# Altium schematic sheet Batmngt.SchDoc
size A4
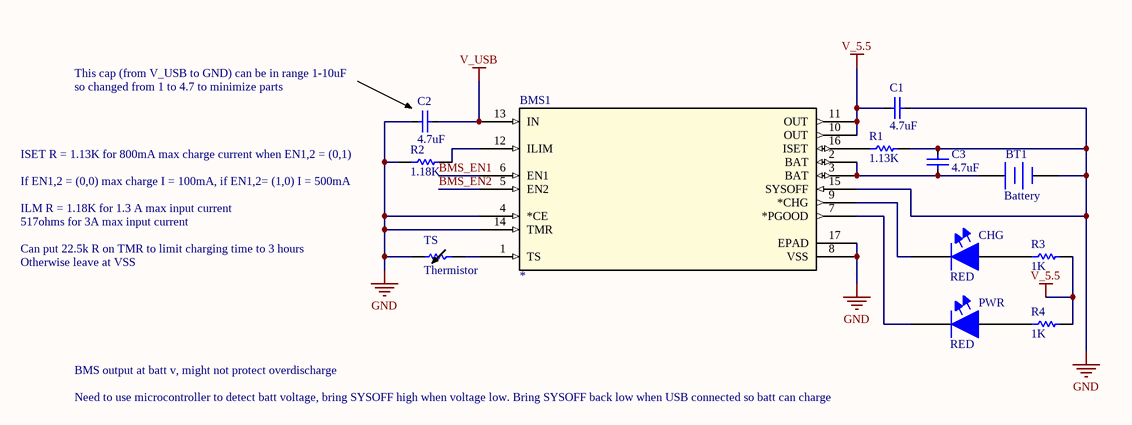
[diagram p0: Batmngt.SchDoc]

## Parts
BMS1  *  [RGT16_1P7X1P7]
BT1  Battery  [BAT-2]
C1  4.7uF  [CAP0603R]
C2  4.7uF  [CAP0603R]
C3  4.7uF  [CAP0603R]
CHG  RED  [0603_LED]
PWR  RED  [0603_LED]
R1  1.13K  [RES0603R]
R2  1.18K  [RES0603R]
R3  1K  [RES0603R]
R4  1K  [RES0603R]
TS  Thermistor  [RES0603R]

## Nets
GND: BMS1.4(*CE) BMS1.8(VSS) BMS1.14(TMR) BMS1.15(SYSOFF) BMS1.17(EPAD) BT1.2(-) C1.2 C2.1 C3.1 R1.2 R2.1 TS.2
V_5.5: BMS1.10(OUT) BMS1.11(OUT) C1.1 R3.2 R4.2
V_USB: BMS1.13(IN) C2.2
BMS_EN1: BMS1.6(EN1)
BMS_EN2: BMS1.5(EN2)
NetBMS1_1: BMS1.1(TS) TS.1
NetBMS1_2: BMS1.2(BAT) BMS1.3(BAT) BT1.1(+) C3.2
NetBMS1_7: BMS1.7(*PGOOD) PWR.K(CATHODE)
NetBMS1_9: BMS1.9(*CHG) CHG.K(CATHODE)
NetBMS1_12: BMS1.12(ILIM) R2.2
NetBMS1_16: BMS1.16(ISET) R1.1
NetCHG_A: CHG.A(ANODE) R3.1
NetPWR_A: PWR.A(ANODE) R4.1

## Notes on the sheet
- (near C2) This cap (from V_USB to GND) can be in range 1-10uF
- so changed from 1 to 4.7 to minimize parts
- (near R2) ISET R = 1.13K for 800mA max charge current when EN1,2 = (0,1)
- (near R2) If EN1,2 = (0,0) max charge I = 100mA, if EN1,2= (1,0) I = 500mA
- ILM R = 1.18K for 1.3 A max input current
- Can put 22.5k R on TMR to limit charging time to 3 hours
- Otherwise leave at VSS
- 517ohms for 3A max input current
- BMS output at batt v, might not protect overdischarge
- Need to use microcontroller to detect batt voltage, bring SYSOFF high when voltage low. Bring SYSOFF back low when USB connected so batt can charge

## Library data of the parts
BMS1 = BQ24079RGTR: Imported; Manufacturer: Texas Instruments; Built_By: EMA_UL_Team; C: Copyright (C) 2015 Accelerated Designs. All rights reserved; Vendor: Vendor; Manufacturer_Part_Number: BQ24079RGTR; Value: Value; Type: Type; RefDes: RefDes
BT1 = Battery: Multicell Battery; Published: 24-Mar-1999; LatestRevisionDate: 17-Jul-2002; LatestRevisionNote: Re-released for DXP Platform.; PackageReference: BAT-2; Publisher: Altium Limited; PackageDescription: Battery; 2 Leads
C1-C3 = C: Capacitor; Manufacturer: Microchip Technology; Manufacturer Part Num: MIC5378YC5-TR; Class I: Passive; Revision: July-2002: Re-released for DXP Platform.; Supplier 1: Digikey; Supplier Part Number 1: *; Supplier Part Number 1: 1611-MIC5378YC5-CT-ND; Value: 4.7uF
CHG PWR = LED: Color: RED; Supplier 1: Digikey
R1-R4 = R: Resistor; Supplier 1: Digikey; Supplier Part Number 1: *
  R1: Value: 1.13K
  R2: Value: 1.18K
  R3 R4: Value: 1K